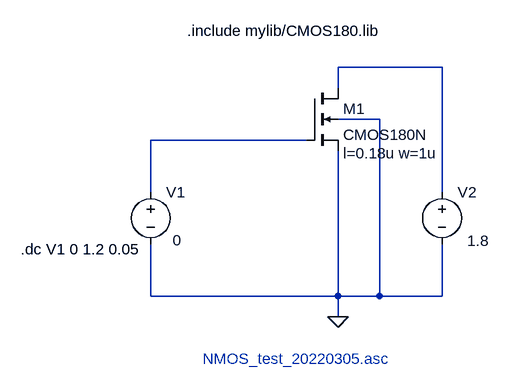
[diagram p0: schematic NMOS_20220305.asc]
NMOS_20220305.asc, the LTspice schematic file:
Version 4
SHEET 1 880 680
WIRE 320 -192 160 -192
WIRE 160 -160 160 -192
WIRE 224 -112 160 -112
WIRE 112 -80 -128 -80
WIRE -128 0 -128 -80
WIRE 320 0 320 -192
WIRE -128 160 -128 80
WIRE 160 160 160 -64
WIRE 160 160 -128 160
WIRE 224 160 224 -112
WIRE 224 160 160 160
WIRE 320 160 320 80
WIRE 320 160 224 160
WIRE 160 192 160 160
FLAG 160 192 0
SYMBOL nmos4 112 -160 R0
WINDOW 123 56 100 Left 2
SYMATTR InstName M1
SYMATTR Value CMOS180N
SYMATTR Value2 l=0.18u w=1u
SYMBOL voltage -128 -16 R0
WINDOW 3 34 90 Left 2
WINDOW 123 0 0 Left 0
WINDOW 39 0 0 Left 0
SYMATTR Value 0
SYMATTR InstName V1
SYMBOL voltage 320 -16 R0
WINDOW 3 39 91 Left 2
WINDOW 123 0 0 Left 0
WINDOW 39 0 0 Left 0
SYMATTR Value 1.8
SYMATTR InstName V2
TEXT -72 -248 Left 2 !.include mylib/CMOS180.lib
TEXT -328 88 Left 2 !.dc V1 0 1.2 0.05
TEXT -48 256 Left 2 ;NMOS_test_20220305.asc

The netlist it stands for:
* NMOS_20220305.asc
M1 N001 N002 0 0 CMOS180N l=0.18u w=1u
V1 N002 0 0
V2 N001 0 1.8
.model NMOS NMOS
.model PMOS PMOS
.lib standard.mos
.include mylib/CMOS180.lib
.dc V1 0 1.2 0.05
* NMOS_test_20220305.asc
.backanno
.end